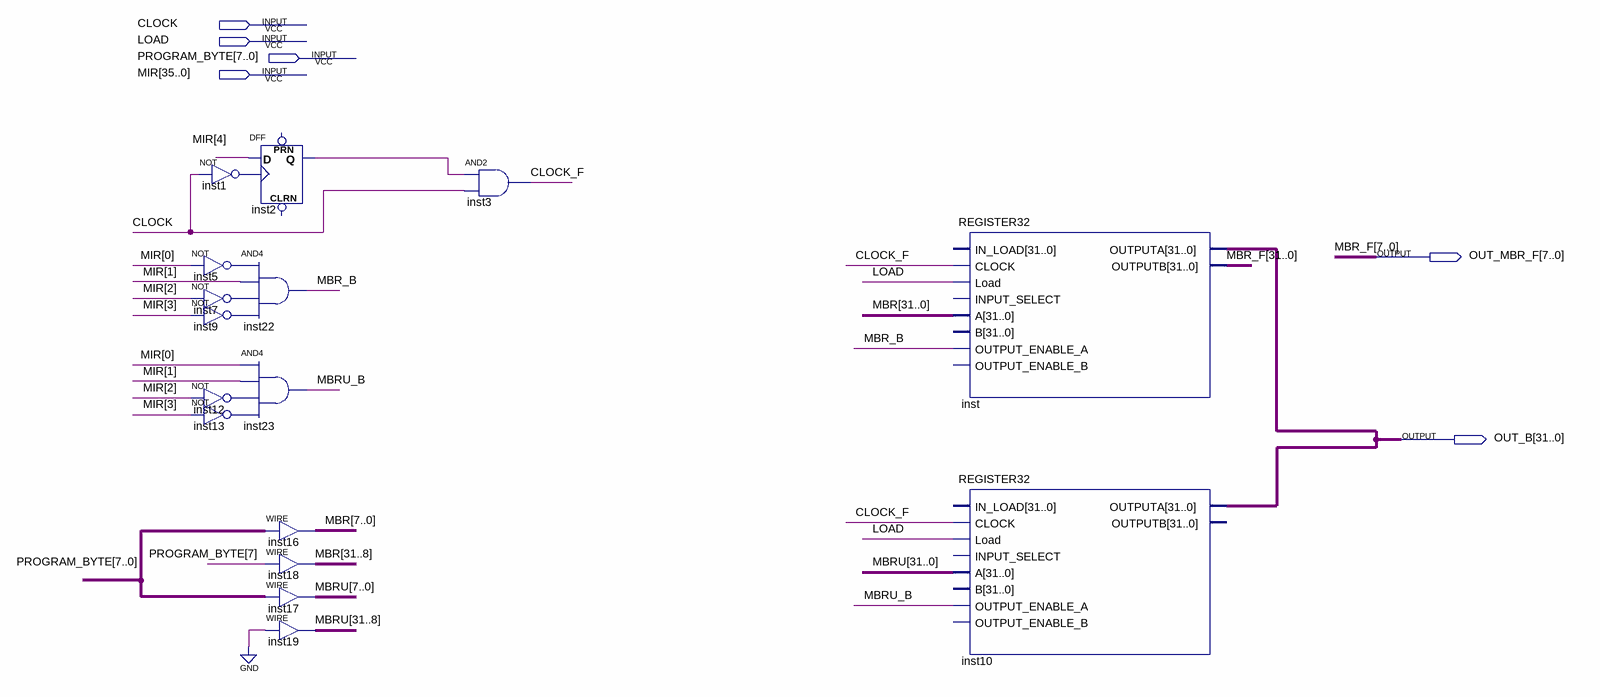
[diagram p0: schematic sheet]
// Quartus schematic MBR.bdf as structural Verilog: 16 symbols, 6 pins
module MBR (
  input  CLOCK,
  input  LOAD,
  input  [7:0] PROGRAM_BYTE,
  input  [35:0] MIR,
  output [7:0] OUT_MBR_F,
  output [31:0] OUT_B
);

  wire CLOCK_F, inst1_out, inst2_q, inst5_out, inst7_out, inst9_out, inst12_out, inst13_out, MBR_B, MBRU_B;
  wire [31:0] MBR, MBRU;
  wire [31:8] MBR_F;

  DFF inst2 (.CLK(inst1_out), .D(MIR[4]), .Q(inst2_q));  // open: CLRN, PRN
  not inst1 (inst1_out, CLOCK);
  not inst5 (inst5_out, MIR[0]);
  and inst22 (MBR_B, inst5_out, MIR[1], inst7_out, inst9_out);
  not inst7 (inst7_out, MIR[2]);
  not inst9 (inst9_out, MIR[3]);
  and inst23 (MBRU_B, MIR[0], MIR[1], inst12_out, inst13_out);
  not inst12 (inst12_out, MIR[2]);
  not inst13 (inst13_out, MIR[3]);
  assign MBR[7:0] = PROGRAM_BYTE;  // WIRE inst16
  assign MBR[31:8] = {24{PROGRAM_BYTE[7]}};  // WIRE inst18
  assign MBRU[7:0] = PROGRAM_BYTE;  // WIRE inst17
  assign MBRU[31:8] = {24{1'b0}};  // WIRE inst19
  and inst3 (CLOCK_F, inst2_q, CLOCK);
  REGISTER32 inst (
    .CLOCK(CLOCK_F), .Load(LOAD), .A(MBR), .OUTPUT_ENABLE_A(MBR_B), .OUTPUTA(OUT_B),
    .OUTPUTB({MBR_F, OUT_MBR_F}));  // open: IN_LOAD, INPUT_SELECT, B, OUTPUT_ENABLE_B
  REGISTER32 inst10 (
    .CLOCK(CLOCK_F), .Load(LOAD), .A(MBRU), .OUTPUT_ENABLE_A(MBRU_B), .OUTPUTA(OUT_B));  // open: IN_LOAD, INPUT_SELECT, B, OUTPUT_ENABLE_B, OUTPUTB

  // Other names for the same wires on the sheet: MBR_F[7:0] = OUT_MBR_F
endmodule
